# Altium schematic sheet zulu_a7_0.SchDoc
size 236 x 313 mm; Author: Christian Tambe; VERSION#: 1.0; Origin: Eagle; OriginPath: C:\Users\tambe\Documents\Electronics\Zulu_A7\Zulu_Altrium\zulu_a7.sch; OriginSheet: 1; OriginDescription: Block Diagram
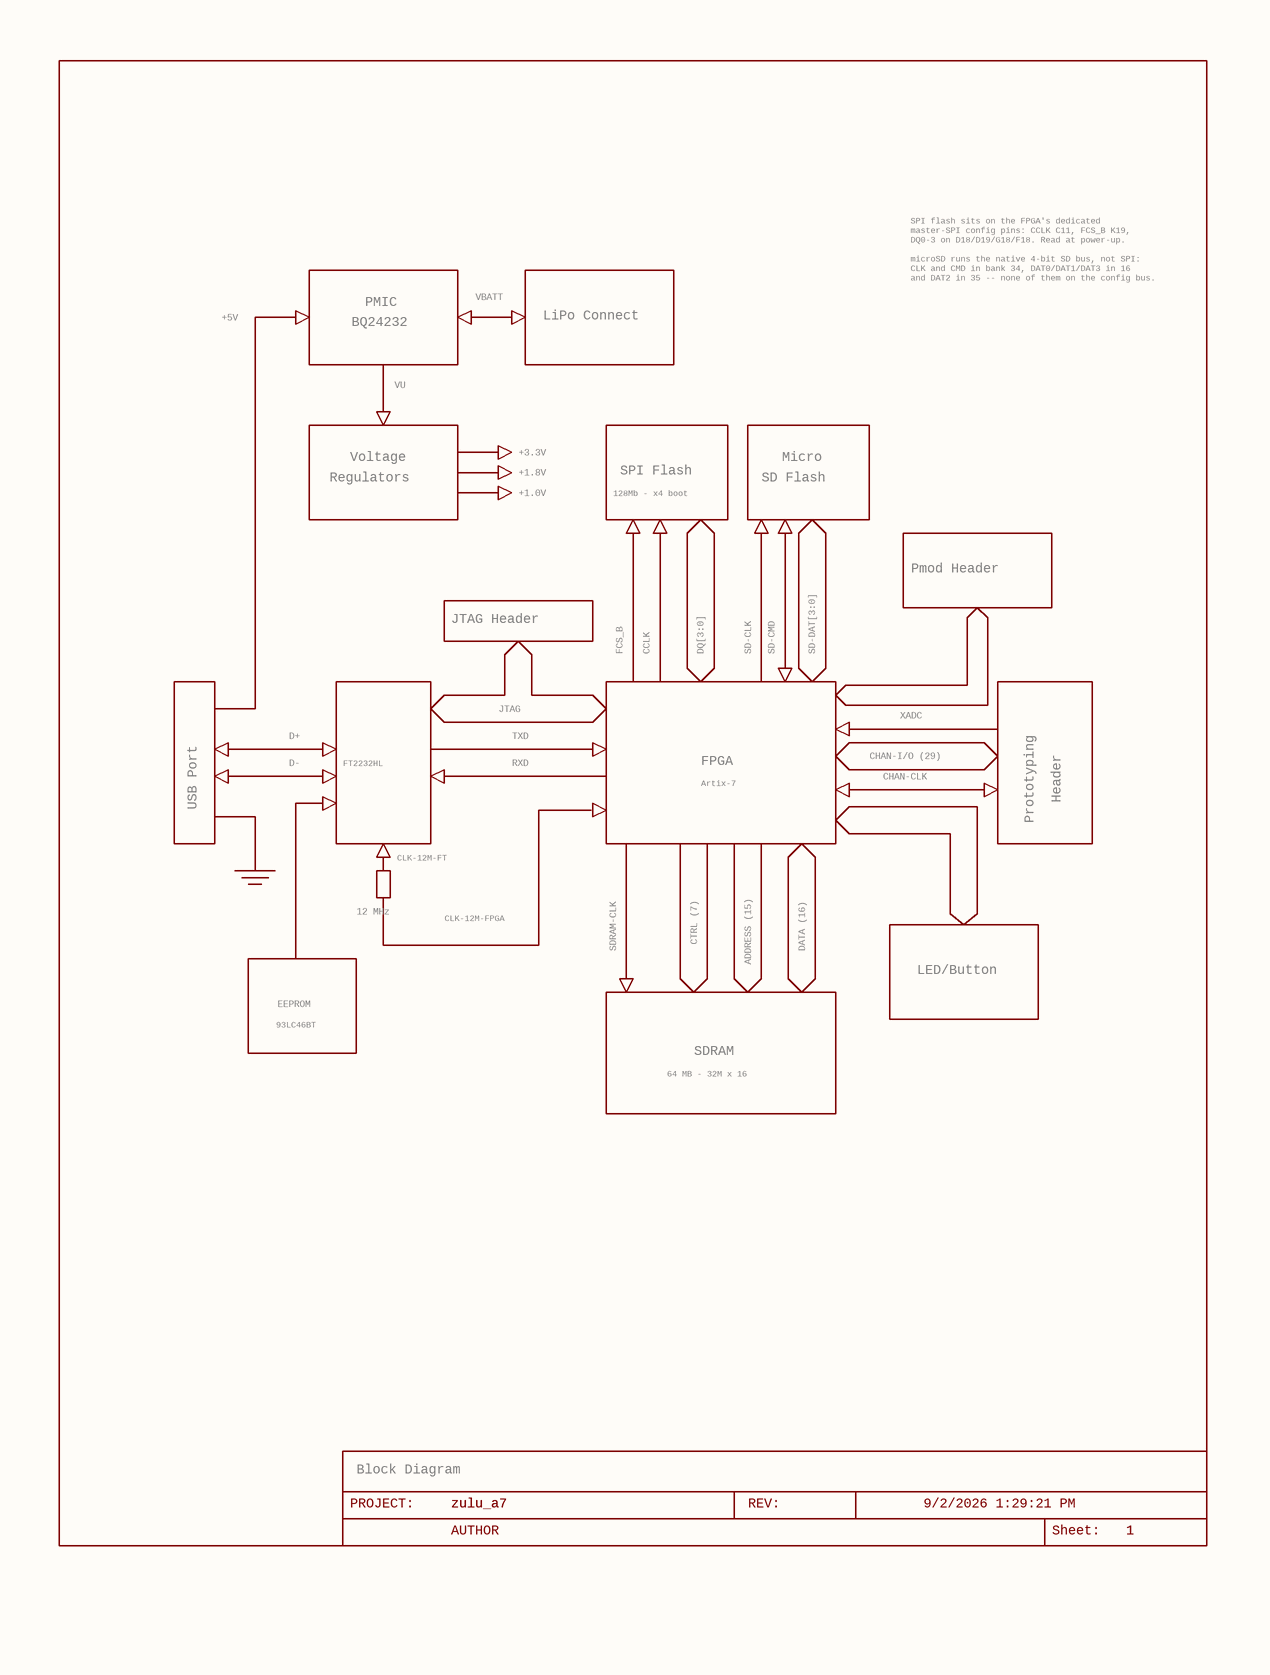
[diagram p0: zulu_a7_0.SchDoc]

## Parts
FRAME1  LAST_DATE_TIME: 9/2/2026 1:29:21 PM  Sheet: Sheet:  SHEET: 1  REV: REV:  PROJECT: PROJECT:  DRAWING_NAME: zulu_a7  (hidden comment: DOCFIELD)  (graphical)

## Notes on the sheet
- SPI flash sits on the FPGA's dedicated
  master-SPI config pins: CCLK C11, FCS_B K19,
  DQ0-3 on D18/D19/G18/F18. Read at power-up.
  microSD runs the native 4-bit SD bus, not SPI:
  CLK and CMD in bank 34, DAT0/DAT1/DAT3 in 16
  and DAT2 in 35 -- none of them on the config bus.
- +5V
- BQ24232
- PMIC
- VBATT
- LiPo Connect
- VU
- Regulators
- Voltage
- +3.3V
- +1.8V
- SPI Flash
- SD Flash
- Micro
- +1.0V
- 128Mb - x4 boot
- Pmod Header
- JTAG Header
- FCS_B
- CCLK
- DQ[3:0]
- SD-CLK
- SD-CMD
- SD-DAT[3:0]
- D+
- JTAG
- TXD
- XADC
- USB Port
- D-
- FT2232HL
- RXD
- FPGA
- Artix-7
- CHAN-I/O (29)
- CHAN-CLK
- Prototyping
- Header
- CLK-12M-FT
- 12 MHz
- CLK-12M-FPGA
- SDRAM-CLK
- CTRL (7)
- DATA (16)
- EEPROM
- ADDRESS (15)
- LED/Button
- 93LC46BT
- 64 MB - 32M x 16
- SDRAM
- (near FRAME1) Block Diagram

## Library data of the parts
FRAME1 = DOCFIELD: DOCUMENT FIELD; GateName_1: G$1; SymbolName_1: DOCFIELD; LibraryName: ctambe; DeviceSetName: DOCFIELD; AUTHOR: AUTHOR